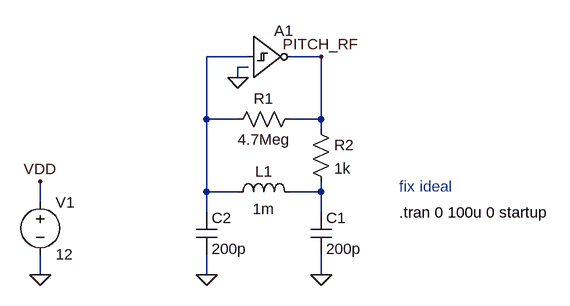
[diagram p0: schematic anafrontend.asc]
anafrontend.asc, the LTspice schematic file:
Version 4
SHEET 1 880 680
WIRE 144 128 80 128
WIRE 256 128 208 128
WIRE 144 144 128 144
WIRE 128 160 128 144
WIRE 80 224 80 128
WIRE 128 224 80 224
WIRE 256 224 256 128
WIRE 256 224 208 224
WIRE 256 240 256 224
WIRE 80 336 80 224
WIRE 128 336 80 336
WIRE 256 336 256 320
WIRE 256 336 208 336
WIRE -176 352 -176 320
WIRE 80 368 80 336
WIRE 256 368 256 336
WIRE -176 464 -176 432
WIRE 80 464 80 432
WIRE 256 464 256 432
FLAG 80 464 0
FLAG 256 464 0
FLAG 128 160 0
FLAG 256 128 PITCH_RF
FLAG -176 464 0
FLAG -176 320 VDD
SYMBOL res 224 208 R90
WINDOW 0 0 56 VBottom 2
WINDOW 3 32 56 VTop 2
SYMATTR InstName R1
SYMATTR Value 4.7Meg
SYMBOL res 240 224 R0
SYMATTR InstName R2
SYMATTR Value 1k
SYMBOL cap 240 368 R0
SYMATTR InstName C1
SYMATTR Value 200p
SYMBOL cap 64 368 R0
SYMATTR InstName C2
SYMATTR Value 200p
SYMBOL ind 112 352 R270
WINDOW 0 32 56 VTop 2
WINDOW 3 5 56 VBottom 2
SYMATTR InstName L1
SYMATTR Value 1m
SYMBOL voltage -176 336 R0
WINDOW 123 0 0 Left 0
WINDOW 39 0 0 Left 0
SYMATTR InstName V1
SYMATTR Value 12
SYMBOL Digital\\schmtinv 144 64 R0
WINDOW 3 0 0 Invisible 0
SYMATTR InstName A1
SYMATTR Value CD40106
TEXT 376 368 Left 2 !.tran 0 100u 0 startup
TEXT 376 328 Left 2 ;fix ideal

The netlist it stands for:
* anafrontend.asc
R1 PITCH_RF N001 4.7Meg
R2 PITCH_RF N002 1k
C1 N002 0 200p
C2 N001 0 200p
L1 N001 N002 1m
V1 VDD 0 12
A1 N001 0 0 0 0 PITCH_RF 0 0 SCHMITT CD40106
.tran 0 100u 0 startup
* fix ideal
.backanno
.end